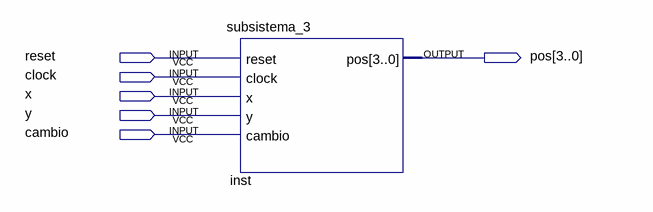
[diagram p0: schematic sheet]
// Quartus schematic prueba_posicionamiento.bdf as structural Verilog: 1 symbols, 6 pins
module prueba_posicionamiento (
  input  reset,
  input  clock,
  input  x,
  input  y,
  input  cambio,
  output [3:0] pos
);

  subsistema_3 inst (.reset(reset), .clock(clock), .x(x), .y(y), .cambio(cambio), .pos(pos));
endmodule
